# EAGLE schematic M6_GPOI_V4.1_after_labelling (EAGLE 9.6.2)
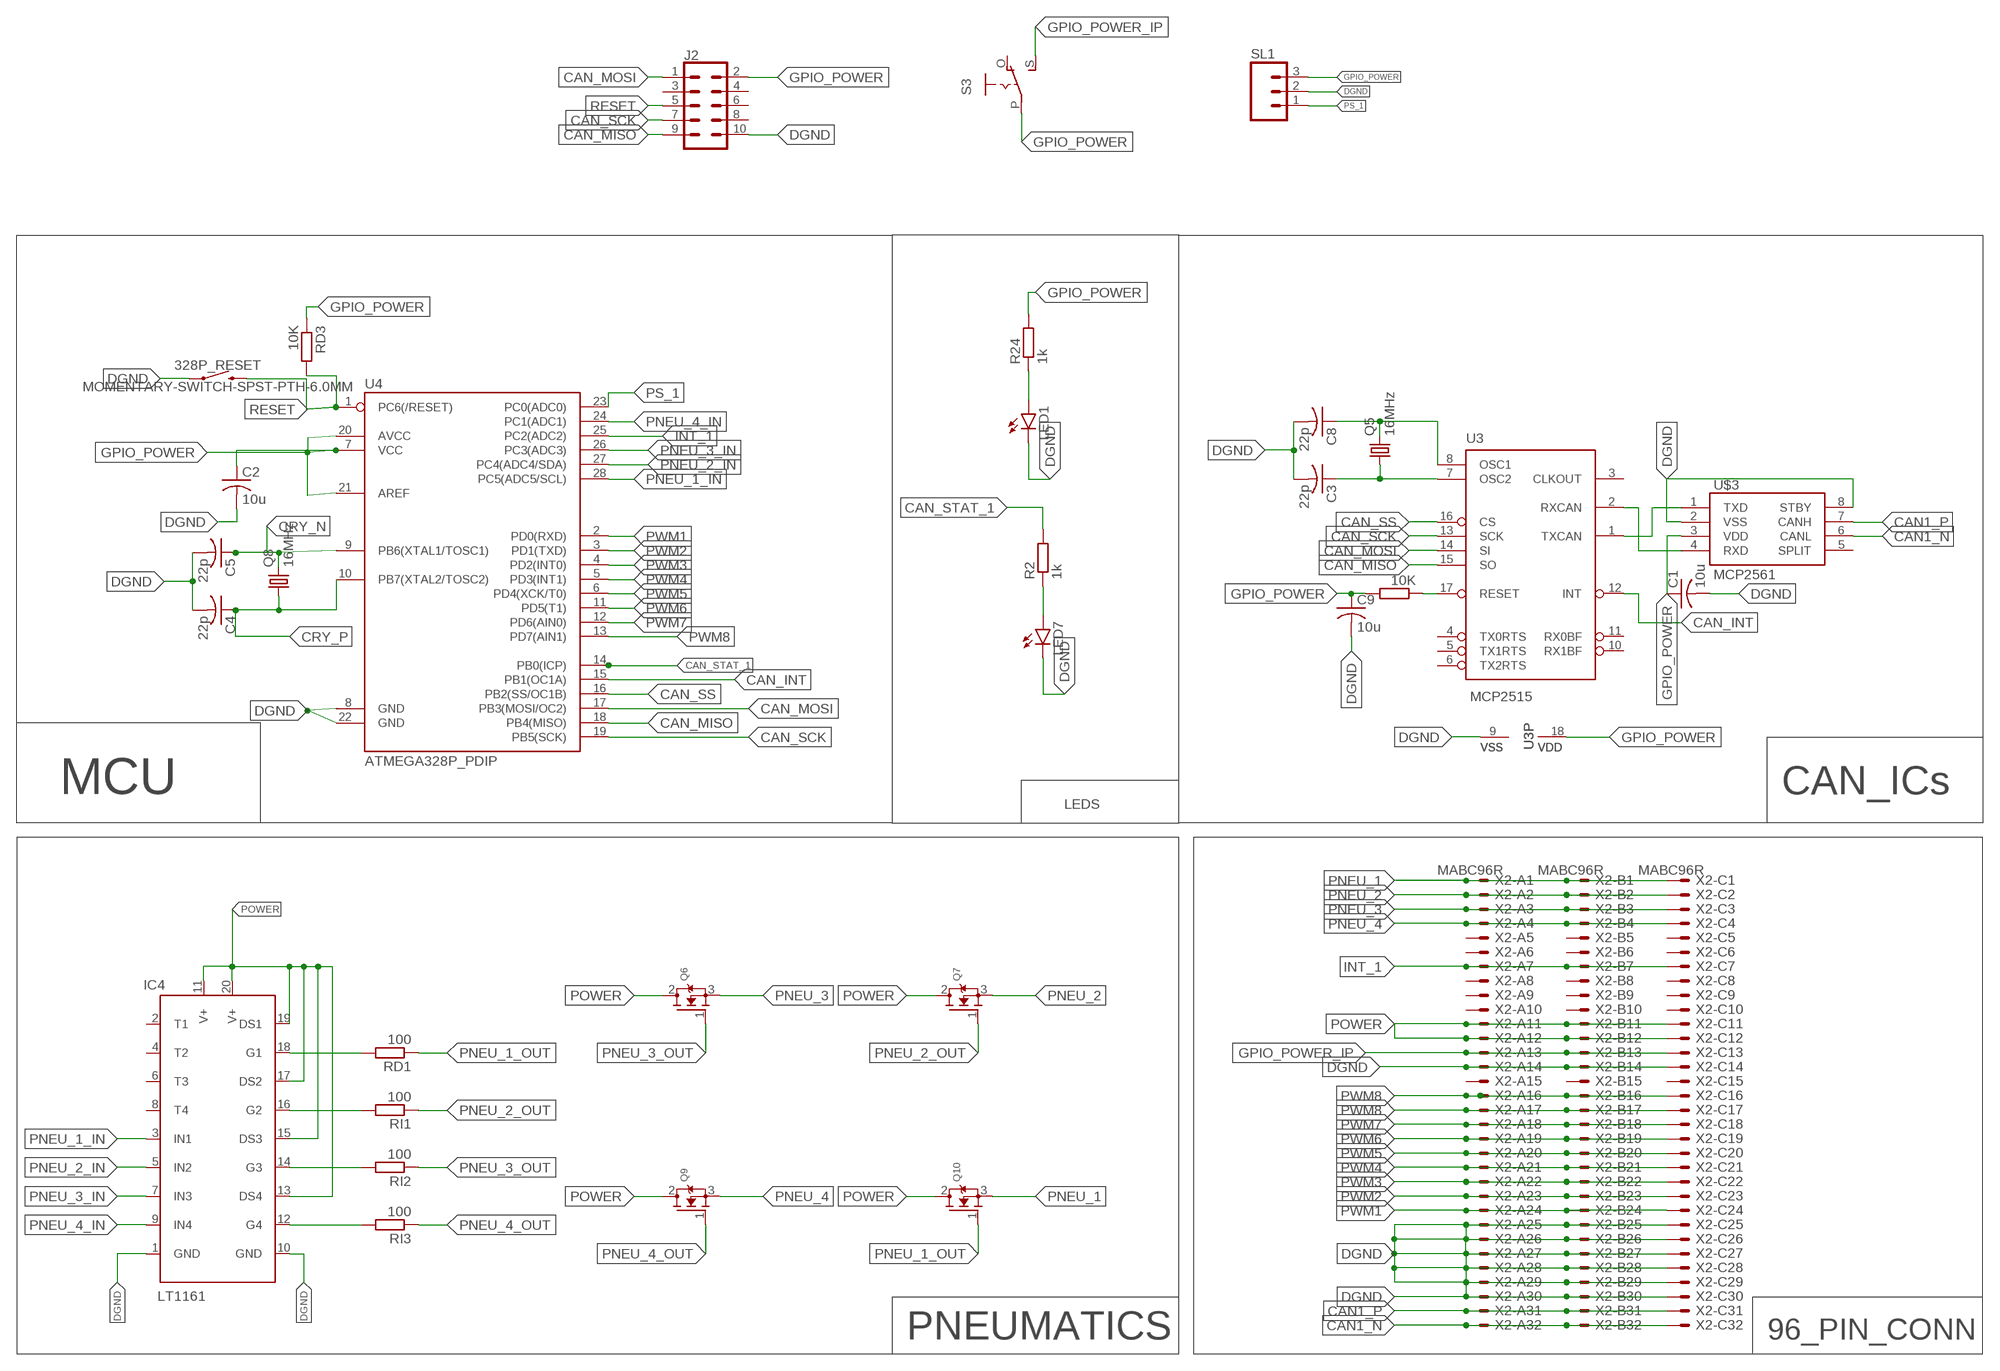
[diagram p0: schematic, sheet 1]

## Parts
328P_RESET  MOMENTARY-SWITCH-SPST-PTH-6.0MM  [TACTILE_SWITCH_PTH_6.0MM]
C1  10u  C-US025-050X050  [C025-050X050]
C2  10u  C-US025-050X050  [C025-050X050]
C3  22p  C-US025-024X044  [C025-024X044]
C4  22p  C-US025-024X044  [C025-024X044]
C5  22p  C-US025-024X044  [C025-024X044]
C8  22p  C-US025-024X044  [C025-024X044]
C9  10u  C-US025-050X050  [C025-050X050]
IC4  LT1161  ROBOSUB_LINEAR-TECHNOLOGY_LT1161_QUAD-HIGH-SIDE-MOSFET-DRIVER_LT1161-SO20SW  [ROBOSUB_LINEAR-TECHNOLOGY_LT1161_QUAD-HIGH-SIDE-MOSFET-DRIVER_SO20]
J2  CONN_05X2SHD  [2X5-SHROUDED]
LED1  LEDCHIPLED_0805  [CHIPLED_0805]
LED7  LEDCHIPLED_0805  [CHIPLED_0805]
Q5  16MHz  CRYSTALHC49S  [HC49/S]
Q6  MOSFET-NGDS_TO220V  [TO220V]
Q7  MOSFET-NGDS_TO220V  [TO220V]
Q8  16MHz  CRYSTALHC49S  [HC49/S]
Q9  MOSFET-NGDS_TO220V  [TO220V]
Q10  MOSFET-NGDS_TO220V  [TO220V]
R2  1k  R-EU_M0805  [M0805]
R24  1k  R-EU_M0805  [M0805]
RD1  100  R-EU_M0805  [M0805]
RD2  10K  R-EU_M0805  [M0805]
RD3  10K  R-EU_M0805  [M0805]
RI1  100  R-EU_M0805  [M0805]
RI2  100  R-EU_M0805  [M0805]
RI3  100  R-EU_M0805  [M0805]
S3  EG1218S  [EG1218]
SL1  MA03  [03P]
U3  MCP2515  MCP2515(MCP2510)P  [DIP18]
U4  ATMEGA328P_PDIP  [DIL28-3]
U$3  MCP2561  [DIP08]
X2  MABC96R  [MABC96R]

## Nets
C_N [CRYSTAL]: C8.1 Q5.2 U3.8(OSC1)
C_P [CRYSTAL]: C3.1 Q5.1 U3.7(OSC2)
CAN1_N [CAN]: U$3.6(CANL) X2.A32 X2.B32 X2.C32
CAN1_P [CAN]: U$3.7(CANH) X2.A31 X2.B31 X2.C31
CAN_INT: U3.12(INT) U4.15(PB1(OC1A))
CAN_MISO: J2.9 U3.15(SO) U4.18(PB4(MISO))
CAN_MOSI: J2.1 U3.14(SI) U4.17(PB3(MOSI/OC2))
CAN_SCK: J2.7 U3.13(SCK) U4.19(PB5(SCK))
CAN_SS: U3.16(CS) U4.16(PB2(SS/OC1B))
CAN_STAT_1: R2.2 U4.14(PB0(ICP))
CRY_N [CRYSTAL]: C5.1 Q8.2 U4.9(PB6(XTAL1/TOSC1))
CRY_P [CRYSTAL]: C4.1 Q8.1 U4.10(PB7(XTAL2/TOSC2))
DGND: 328P_RESET.1 C1.2 C2.2 C3.2 C4.2 C5.2 C8.2 C9.2 IC4.1(GND) IC4.10(GND) J2.10 LED1.C LED7.C SL1.2 U3.9(VSS) U4.8(GND) U4.22(GND) U$3.2(VSS) U$3.8(STBY) X2.A14 X2.A25 X2.A26 X2.A27 X2.A28 X2.A29 X2.A30 X2.B14 X2.B25 X2.B26 X2.B27 X2.B28 X2.B29 X2.B30 X2.C14 X2.C25 X2.C26 X2.C27 X2.C28 X2.C29 X2.C30
G1: IC4.18(G1) RD1.2
GPIO_POWER [POWER]: C1.1 C2.1 C9.1 J2.2 R24.2 RD2.2 RD3.1 S3.P SL1.3 U3.18(VDD) U4.7(VCC) U4.20(AVCC) U4.21(AREF) U$3.3(VDD)
GPIO_POWER_IP: S3.S X2.A13 X2.B13 X2.C13
INT_1: U4.25(PC2(ADC2)) X2.A7 X2.B7 X2.C7
N$1: LED7.A R2.1
N$6: U3.1(TXCAN) U$3.1(TXD)
N$7: U3.2(RXCAN) U$3.4(RXD)
N$8: RD2.1 U3.17(RESET)
N$29: IC4.14(G3) RI2.2
N$30: IC4.12(G4) RI3.2
N$31: LED1.A R24.1
PNEU_1: Q10.3(S) X2.A1 X2.B1 X2.C1
PNEU_1_IN: IC4.3(IN1) U4.28(PC5(ADC5/SCL))
PNEU_1_OUT: Q10.1(G) RD1.1
PNEU_2: Q7.3(S) X2.A2 X2.B2 X2.C2
PNEU_2_IN: IC4.5(IN2) U4.27(PC4(ADC4/SDA))
PNEU_2_OUT: Q7.1(G) RI1.1
PNEU_3: Q6.3(S) X2.A3 X2.B3 X2.C3
PNEU_3_IN: IC4.7(IN3) U4.26(PC3(ADC3))
PNEU_3_OUT: Q6.1(G) RI2.1
PNEU_4: Q9.3(S) X2.A4 X2.B4 X2.C4
PNEU_4_IN: IC4.9(IN4) U4.24(PC1(ADC1))
PNEU_4_OUT: Q9.1(G) RI3.1
POWER: IC4.11(V+) IC4.13(DS4) IC4.15(DS3) IC4.17(DS2) IC4.19(DS1) IC4.20(V+) Q6.2(D) Q7.2(D) Q9.2(D) Q10.2(D) X2.A11 X2.A12 X2.B11 X2.B12 X2.C11 X2.C12
PS_1: SL1.1 U4.23(PC0(ADC0))
PWM1: U4.2(PD0(RXD)) X2.A24 X2.B24 X2.C24
PWM2: U4.3(PD1(TXD)) X2.A23 X2.B23 X2.C23
PWM3: U4.4(PD2(INT0)) X2.A22 X2.B22 X2.C22
PWM4: U4.5(PD3(INT1)) X2.A21 X2.B21 X2.C21
PWM5: U4.6(PD4(XCK/T0)) X2.A20 X2.B20 X2.C20
PWM6: U4.11(PD5(T1)) X2.A19 X2.B19 X2.C19
PWM7: U4.12(PD6(AIN0)) X2.A18 X2.B18 X2.C18
PWM8: U4.13(PD7(AIN1)) X2.A16 X2.A17 X2.B16 X2.B17 X2.C16 X2.C17
RESET: 328P_RESET.3 J2.5 RD3.2 U4.1(PC6(/RESET))
S1: IC4.16(G2) RI1.2
Unconnected: IC4.2(T1) IC4.4(T2) IC4.6(T3) IC4.8(T4) J2.3 J2.4 J2.6 J2.8 S3.O U3.3(CLKOUT) U3.4(TX0RTS) U3.5(TX1RTS) U3.6(TX2RTS) U3.10(RX1BF) U3.11(RX0BF) U$3.5(SPLIT) X2.A5 X2.A6 X2.A8 X2.A9 X2.A10 X2.A15 X2.B5 X2.B6 X2.B8 X2.B9 X2.B10 X2.B15 X2.C5 X2.C6 X2.C8 X2.C9 X2.C10 X2.C15

## Notes on the sheet
- MCU | CAN_ICs
- LEDS
- PNEUMATICS | 96_PIN_CONN

## Library data of the parts
328P_RESET = SparkFun-Switches:MOMENTARY-SWITCH-SPST: Momentary Switch (Pushbutton) - SPST Normally-open (NO) SPST momentary switches (buttons, pushbuttons). Variants PTH-12MM - 12mm square, through-hole Momentary Pushbutton Switch - 12mm Square <https://www.sparkfun.com/products/9190> (COM-09190) PTH-6.0MM, PTH-6.0MM-KIT - 6.0mm square, through-hole Mini Pushbutton Switch <https://www.sparkfun.com/products/97> (COM-00097) KIT package intended for soldering kit's - only one side of pads' copper is exposed. PTH-RIGHT-ANGLE-KIT - Right-angle, through-hole Right Angle Tactile Button <https://www.sparkfun.com/products/10791> - Used on SparkFun BigTime Watch Kit <https://www.sparkfun.com/products/11734> SMD-12MM - 12mm square, surface-mount Tactile Button - SMD (12mm) <https://www.sparkfun.com/products/12993> (COM-12993) Used on SparkFun PicoBoard <https://www.sparkfun.com/products/11888> SMD-4.5MM - 4.5mm Square Trackball Switch Used on SparkFun Blackberry Trackballer Breakout <https://www.sparkfun.com/products/13169> SMD-4.6MMX2.8MM - 4.60mm x 2.80mm, surface mount Used on SparkFun SAMD21 Mini Breakout <https://www.sparkfun.com/products/13664> SMD-5.2MM, SMD-5.2-REDUNDANT - 5.2mm square, surface-mount Mini Pushbutton Switch - SMD <https://www.sparkfun.com/products/8720> (COM-08720) Used on Arduino Pro Mini <https://www.sparkfun.com/products/11114> REDUNDANT package connects both switch circuits together SMD-6.0X3.5MM - 6.0 x 3.5mm, surface mount Momentary Reset Switch SMD <https://www.sparkfun.com/products/8229> (COM-08229) SMD-6.2MM-TALL - 6.2mm square, surface mount Tactile Button - SMD (6mm) <https://www.sparkfun.com/products/12992> Used on SparkFun Digital Sandbox <https://www.sparkfun.com/products/12651> SMD-RIGHT-ANGLE - Right-angle, surface mount Used on SparkFun Block for Intel® Edison - Arduino <https://www.sparkfun.com/products/13036>; PROD_ID: SWCH-08441; SF_SKU: COM-00097
C1 C2 C9 = adafruit:C-US: CAPACITOR, American symbol
C3-C5 C8 = resistor:C-US: CAPACITOR, American symbol
IC4 = LT1161:ROBOSUB_LINEAR-TECHNOLOGY_LT1161_QUAD-HIGH-SIDE-MOSFET-DRIVER_LT1161-SO20: Three Phase Bridge N-Channel MOSFET Driver 80V, 0.5A Source: http://www.intersil.com/data/fn/fn4220.pdf; MF: INTERSIL; MPN: HIP4086ABZ; OC_FARNELL: 1561974; OC_NEWARK: 20J4468
J2 = SparkFun-Connectors:CONN_05X2: Multi connection point. Often used as Generic Header-pin footprint for 0.1 inch spaced/style header connections For AVR SPI programming port, see special device with nice symbol: "AVR_SPI_PROG_5x2.dev" You can populate with any combo of single row headers, but if you'd like an exact match, check these: 2x5 AVR ICSP Male Header <https://www.sparkfun.com/products/778> (PRT-00778) 2x5 Pin Shrouded Header <https://www.sparkfun.com/products/8506> (PRT-08506) On any of the 0.1 inch spaced packages, you can populate with these: Break Away Headers - Straight <https://www.sparkfun.com/products/116> (PRT-00116) Break Away Male Headers - Right Angle <https://www.sparkfun.com/products/553> (PRT-00553) Female Headers <https://www.sparkfun.com/products/115> (PRT-00115) Break Away Headers - Machine Pin <https://www.sparkfun.com/products/117> (PRT-00117) Break Away Female Headers - Swiss Machine Pin <https://www.sparkfun.com/products/743> (PRT-00743) Special note: the shrouded connector mates well with our 5x2 ribbon cables: 2x5 Pin IDC Ribbon Cable <https://www.sparkfun.com/products/8535> (PRT-08535); PROD_ID: CONN-08671; SF_ID: PRT-08506
LED1 LED7 = led:LED: LED OSRAM: - CHIPLED LG R971, LG N971, LY N971, LG Q971, LY Q971, LO R971, LY R971 LH N974, LH R974 LS Q976, LO Q976, LY Q976 LO Q996 - Hyper CHIPLED LW Q18S LB Q993, LB Q99A, LB R99A - SideLED LS A670, LO A670, LY A670, LG A670, LP A670 LB A673, LV A673, LT A673, LW A673 LH A674 LY A675 LS A676, LA A676, LO A676, LY A676, LW A676 LS A679, LY A679, LG A679 - Hyper Micro SIDELED® LS Y876, LA Y876, LO Y876, LY Y876 LT Y87S - SmartLED LW L88C, LW L88S LB L89C, LB L89S, LG L890 LS L89K, LO L89K, LY L89K LS L896, LA L896, LO L896, LY L896 - TOPLED LS T670, LO T670, LY T670, LG T670, LP T670 LSG T670, LSP T670, LSY T670, LOP T670, LYG T670 LG T671, LOG T671, LSG T671 LB T673, LV T673, LT T673, LW T673 LH T674 LS T676, LA T676, LO T676, LY T676, LB T676, LH T676, LSB T676, LW T676 LB T67C, LV T67C, LT T67C, LS T67K, LO T67K, LY T67K, LW E67C LS E67B, LA E67B, LO E67B, LY E67B, LB E67C, LV E67C, LT E67C LW T67C LS T679, LY T679, LG T679 LS T770, LO T770, LY T770, LG T770, LP T770 LB T773, LV T773, LT T773, LW T773 LH T774 LS E675, LA E675, LY E675, LS T675 LS T776, LA T776, LO T776, LY T776, LB T776 LHGB T686 LT T68C, LB T68C - Hyper Mini TOPLED® LB M676 - Mini TOPLED Santana® LG M470 LS M47K, LO M47K, LY M47K Source: http://www.osram.convergy.de LUXEON: - LUMILED® LXK2-PW12-R00, LXK2-PW12-S00, LXK2-PW14-U00, LXK2-PW14-V00 LXK2-PM12-R00, LXK2-PM12-S00, LXK2-PM14-U00 LXK2-PE12-Q00, LXK2-PE12-R00, LXK2-PE12-S00, LXK2-PE14-T00, LXK2-PE14-U00 LXK2-PB12-K00, LXK2-PB12-L00, LXK2-PB12-M00, LXK2-PB14-N00, LXK2-PB14-P00, LXK2-PB14-Q00 LXK2-PR12-L00, LXK2-PR12-M00, LXK2-PR14-Q00, LXK2-PR14-R00 LXK2-PD12-Q00, LXK2-PD12-R00, LXK2-PD12-S00 LXK2-PH12-R00, LXK2-PH12-S00 LXK2-PL12-P00, LXK2-PL12-Q00, LXK2-PL12-R00 Source: www.luxeon.com KINGBRIGHT: KA-3528ASYC Source: www.kingbright.com
Q5 Q8 = crystal:CRYSTAL: CRYSTAL; OC_FARNELL: 1667008; OC_NEWARK: unknown
Q6 Q7 Q9 Q10 = adafruit:MOSFET-N: N-Channel Mosfet 2N7002E - 60V 260mA SOT23 [Digikey: 2N7002ET1GOSTR-ND] - REEL BSH103 - 30V 850mA SOT23 [Digikey: 568-5013-1-ND]
R2 R24 RD1-RD3 RI1-RI3 = rcl:R-EU_: RESISTOR, European symbol; SPICEPREFIX: R
S3 = adafruit:EG1218: SLIDING SWITCH 0.1" spacing through hole, vertical SPDT slide switch http://www.ladyada.net/library/pcb/eaglelibrary.html
SL1 = con-amp-quick:MA03: AMP QUICK CONNECTOR; OC_FARNELL: unknown; OC_NEWARK: unknown
U3 = SparkFun-IC-Comms:MCP2515(MCP2510): CAN controller with SPI interface The MCP2515 controller supercedes the MCP2510 while addressing all errata associated with it. The two devices are pin compatible, either can be used with this device. 18-pin package SOIC Simple SPI interface to any MCU. One-shot mode ensures message transmission is attempted only once Databyte filtering Start-of-Frame (SOF) output Low-power CMOS Technology Datasheet <http://www.sparkfun.com/datasheets/DevTools/Arduino/MCP2515.pdf> SparkFun Products CAN-BUS Shield <https://www.sparkfun.com/products/13262> (DEV-13262); PROD_ID: NA-XXXXX
U4 = SparkFun-DigitalIC:ATMEGA328P_PDIP: uC used in the Arduino 32kb flash, 1k EEPROM, 2k SRAM This is the through-hole version of this chip.
U$3 = LMZ22005TZ:MCP2561
X2 = con-vg:MABC96R: CONNECTOR male, 96 pins, type R, rows ABC, grid 2.54 mm; OC_FARNELL: unknown

## Net classes
1 CAN: width 0.406 mm, drill 0.381 mm, clearance 0.381 mm
2 POWER: width 0.203 mm
3 CRYSTAL: width 0.406 mm